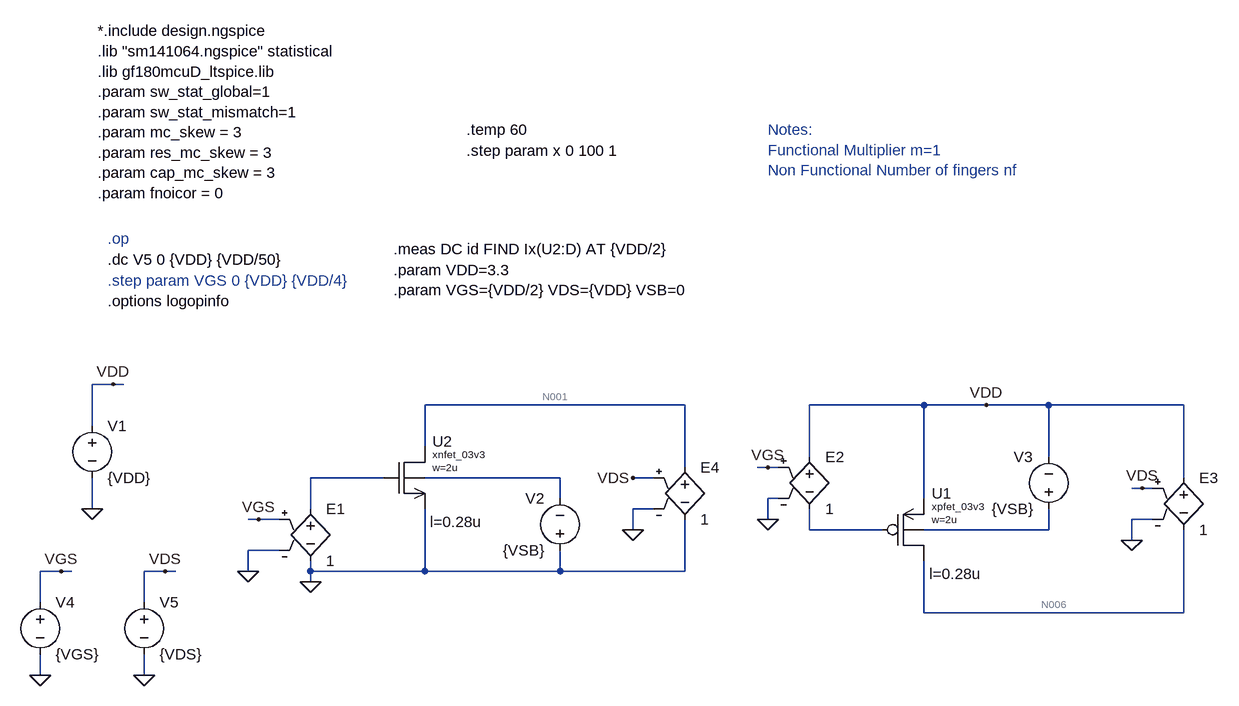
[diagram p0: schematic DC_Sweep_03V3_MC.asc]
DC_Sweep_03V3_MC.asc, the LTspice schematic file:
Version 4.1
SHEET 1 6080 1492
WIRE 80 -48 48 -48
WIRE 96 -48 80 -48
WIRE 960 -16 560 -16
WIRE 1328 -16 1152 -16
WIRE 1424 -16 1328 -16
WIRE 1520 -16 1424 -16
WIRE 1728 -16 1520 -16
WIRE 48 16 48 -48
WIRE 560 48 560 -16
WIRE 1152 64 1152 -16
WIRE 1520 64 1520 -16
WIRE 960 80 960 -16
WIRE 1088 80 1072 80
WIRE 1104 80 1088 80
WIRE 496 96 384 96
WIRE 768 96 560 96
WIRE 912 96 880 96
WIRE 1728 96 1728 -16
WIRE 1664 112 1648 112
WIRE 1680 112 1664 112
WIRE 768 128 768 96
WIRE 1104 128 1088 128
WIRE 1328 128 1328 -16
WIRE 48 144 48 96
WIRE 384 144 384 96
WIRE 912 144 880 144
WIRE 304 160 288 160
WIRE 336 160 304 160
WIRE 1088 160 1088 128
WIRE 1680 160 1648 160
WIRE 880 176 880 144
WIRE 1152 176 1152 144
WIRE 1264 176 1152 176
WIRE 1520 176 1520 144
WIRE 1520 176 1328 176
WIRE 1648 192 1648 160
WIRE 336 208 288 208
WIRE 0 240 -32 240
WIRE 16 240 0 240
WIRE 160 240 128 240
WIRE 176 240 160 240
WIRE 288 240 288 208
WIRE 384 240 384 224
WIRE 560 240 560 144
WIRE 560 240 384 240
WIRE 768 240 768 208
WIRE 768 240 560 240
WIRE 960 240 960 160
WIRE 960 240 768 240
WIRE 384 256 384 240
WIRE -32 288 -32 240
WIRE 128 288 128 240
WIRE 1328 304 1328 224
WIRE 1728 304 1728 176
WIRE 1728 304 1328 304
WIRE -32 400 -32 368
WIRE 128 400 128 368
FLAG 80 -48 VDD
FLAG 48 144 0
FLAG 384 256 0
FLAG 1424 -16 VDD
FLAG 288 240 0
FLAG 1088 160 0
FLAG -32 400 0
FLAG 0 240 VGS
FLAG 304 160 VGS
FLAG 1088 80 VGS
FLAG 1648 192 0
FLAG 880 176 0
FLAG 1664 112 VDS
FLAG 880 96 VDS
FLAG 128 400 0
FLAG 160 240 VDS
SYMBOL voltage 48 0 R0
WINDOW 123 0 0 Left 0
WINDOW 39 0 0 Left 0
SYMATTR InstName V1
SYMATTR Value {VDD}
SYMBOL voltage 768 224 R180
WINDOW 0 24 96 Left 2
WINDOW 3 24 16 Left 2
SYMATTR InstName V2
SYMATTR Value {VSB}
SYMBOL voltage 1520 160 R180
WINDOW 0 24 96 Left 2
WINDOW 3 24 16 Left 2
SYMATTR InstName V3
SYMATTR Value {VSB}
SYMBOL e 384 128 R0
SYMATTR InstName E1
SYMATTR Value 1
SYMBOL e 1152 48 R0
SYMATTR InstName E2
SYMATTR Value 1
SYMBOL voltage -32 272 R0
SYMATTR InstName V4
SYMATTR Value {VGS}
SYMBOL e 1728 80 R0
SYMATTR InstName E3
SYMATTR Value 1
SYMBOL e 960 64 R0
SYMATTR InstName E4
SYMATTR Value 1
SYMBOL voltage 128 272 R0
SYMATTR InstName V5
SYMATTR Value {VDS}
SYMBOL xpch 1280 128 R0
WINDOW 123 56 116 Left 2
SYMATTR Value2 l=0.28u
SYMATTR InstName U1
SYMATTR Value w=2u
SYMATTR SpiceModel xpfet_03v3
SYMBOL xnch 512 48 R0
WINDOW 123 56 116 Left 2
SYMATTR Value2 l=0.28u
SYMATTR InstName U2
SYMATTR Value w=2u
SYMATTR SpiceModel xnfet_03v3
TEXT 72 -272 Left 2 ;.op
TEXT 72 -240 Left 2 !.dc V5 0 {VDD} {VDD/50}
TEXT 512 -224 Left 2 !.param VDD=3.3 \n.param VGS={VDD/2} VDS={VDD} VSB=0
TEXT 72 -208 Left 2 ;.step param VGS 0 {VDD} {VDD/4}
TEXT 72 -176 Left 2 !.options logopinfo
TEXT 56 -592 Left 2 !*.include design.ngspice\n.lib "sm141064.ngspice" statistical\n.lib gf180mcuD_ltspice.lib\n.param sw_stat_global=1\n.param sw_stat_mismatch=1\n.param mc_skew = 3\n.param res_mc_skew = 3\n.param cap_mc_skew = 3\n.param fnoicor = 0
TEXT 624 -440 Left 2 !.temp 60
TEXT 624 -408 Left 2 !.step param x 0 100 1
TEXT 512 -256 Left 2 !.meas DC id FIND Ix(U2:D) AT {VDD/2}
TEXT 1088 -440 Left 2 ;Notes:\nFunctional Multiplier m=1\nNon Functional Number of fingers nf

The netlist it stands for:
* DC_Sweep_03V3_MC.asc
V1 VDD 0 {VDD}
V2 0 N003 {VSB}
V3 N005 VDD {VSB}
E1 N002 0 VGS 0 1
E2 VDD N004 VGS 0 1
V4 VGS 0 {VGS}
E3 VDD N006 VDS 0 1
E4 N001 0 VDS 0 1
V5 VDS 0 {VDS}
X§U1 N006 N004 VDD N005 xpfet_03v3 w=2u l=0.28u  ; pins D G S B
X§U2 N001 N002 0 N003 xnfet_03v3 w=2u l=0.28u  ; pins D G S B
* .op
.dc V5 0 {VDD} {VDD/50}
.param VDD=3.3
.param VGS={VDD/2} VDS={VDD} VSB=0
* .step param VGS 0 {VDD} {VDD/4}
.options logopinfo
*.include design.ngspice
.lib "sm141064.ngspice" statistical
.lib gf180mcuD_ltspice.lib
.param sw_stat_global=1
.param sw_stat_mismatch=1
.param mc_skew = 3
.param res_mc_skew = 3
.param cap_mc_skew = 3
.param fnoicor = 0
.temp 60
.step param x 0 100 1
.meas DC id FIND Ix(U2:D) AT {VDD/2}
* Notes:
* Functional Multiplier m=1
* Non Functional Number of fingers nf
.backanno
.end

* Results of the author's LTspice run, read from the files saved beside the schematic
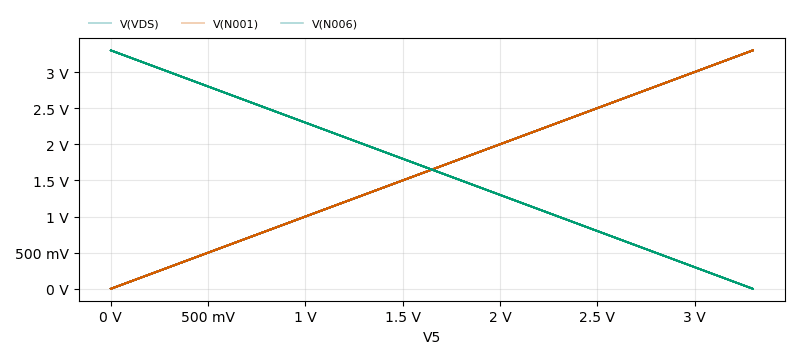
[diagram p1: DC transfer characteristic of DC_Sweep_03V3_MC.asc, plotted from the saved traces]
* DC transfer characteristic, 101 runs:
*   V(VDS) [run 1]: 0 V at V5=0 V, 3.3 V at V5=3.3 V, min 0 V, max 3.3 V
*   V(VDS) [run 2]: 0 V at V5=0 V, 3.3 V at V5=3.3 V, min 0 V, max 3.3 V
*   V(VDS) [run 3]: 0 V at V5=0 V, 3.3 V at V5=3.3 V, min 0 V, max 3.3 V
*   V(VDS) [run 4]: 0 V at V5=0 V, 3.3 V at V5=3.3 V, min 0 V, max 3.3 V
*   V(VDS) [run 5]: 0 V at V5=0 V, 3.3 V at V5=3.3 V, min 0 V, max 3.3 V
*   V(VDS) [run 6]: 0 V at V5=0 V, 3.3 V at V5=3.3 V, min 0 V, max 3.3 V
*   V(VDS) [run 7]: 0 V at V5=0 V, 3.3 V at V5=3.3 V, min 0 V, max 3.3 V
*   V(VDS) [run 8]: 0 V at V5=0 V, 3.3 V at V5=3.3 V, min 0 V, max 3.3 V
*   V(N001) [run 1]: 0 V at V5=0 V, 3.3 V at V5=3.3 V, min 0 V, max 3.3 V
*   V(N001) [run 2]: 0 V at V5=0 V, 3.3 V at V5=3.3 V, min 0 V, max 3.3 V
*   V(N001) [run 3]: 0 V at V5=0 V, 3.3 V at V5=3.3 V, min 0 V, max 3.3 V
*   V(N001) [run 4]: 0 V at V5=0 V, 3.3 V at V5=3.3 V, min 0 V, max 3.3 V
*   V(N001) [run 5]: 0 V at V5=0 V, 3.3 V at V5=3.3 V, min 0 V, max 3.3 V
*   V(N001) [run 6]: 0 V at V5=0 V, 3.3 V at V5=3.3 V, min 0 V, max 3.3 V
*   V(N001) [run 7]: 0 V at V5=0 V, 3.3 V at V5=3.3 V, min 0 V, max 3.3 V
*   V(N001) [run 8]: 0 V at V5=0 V, 3.3 V at V5=3.3 V, min 0 V, max 3.3 V
*   V(N006) [run 1]: 3.3 V at V5=0 V, 0 V at V5=3.3 V, min 0 V, max 3.3 V
*   V(N006) [run 2]: 3.3 V at V5=0 V, 0 V at V5=3.3 V, min 0 V, max 3.3 V
*   V(N006) [run 3]: 3.3 V at V5=0 V, 0 V at V5=3.3 V, min 0 V, max 3.3 V
*   V(N006) [run 4]: 3.3 V at V5=0 V, 0 V at V5=3.3 V, min 0 V, max 3.3 V
*   V(N006) [run 5]: 3.3 V at V5=0 V, 0 V at V5=3.3 V, min 0 V, max 3.3 V
*   V(N006) [run 6]: 3.3 V at V5=0 V, 0 V at V5=3.3 V, min 0 V, max 3.3 V
*   V(N006) [run 7]: 3.3 V at V5=0 V, 0 V at V5=3.3 V, min 0 V, max 3.3 V
*   V(N006) [run 8]: 3.3 V at V5=0 V, 0 V at V5=3.3 V, min 0 V, max 3.3 V
* From the log:
*   Measurement: id
*     step  Ix(U2:D)   at
*        1  0.000345501961419  1.65
*        2  0.000250997283729  1.65
*        3  0.000360172154615  1.65
*        4  0.000198675537831  1.65
*        5  0.000331643124809  1.65
*        6  0.000306394125801  1.65
*        7  0.000254957034485  1.65
*        8  0.000312837131787  1.65
*        9  0.000322775711538  1.65
*       10  0.000266885297606  1.65
*       11  0.000344073196175  1.65
*       12  0.000299871026073  1.65
*       13  0.000228627191973  1.65
*       14  0.000296763493679  1.65
*       15  0.00032905844273  1.65
*       16  0.00024403493444  1.65
*       17  0.000298732775263  1.65
*       18  0.000302630767692  1.65
*       19  0.000217457447434  1.65
*       20  0.000226773190661  1.65
*       21  0.00029978324892  1.65
*       22  0.000368090579286  1.65
*       23  0.000288365437882  1.65
*       24  0.000223202645429  1.65
*       25  0.000277218350675  1.65
*       26  0.000294507946819  1.65
*       27  0.0001883393561  1.65
*       28  0.000286523922114  1.65
*       29  0.00031237769872  1.65
*       30  0.000306591799017  1.65
*       31  0.000239875880652  1.65
*       32  0.000330096518155  1.65
*       33  0.000305157416733  1.65
*       34  0.000259106134763  1.65
*       35  0.000316890276736  1.65
*       36  0.000272066186881  1.65
*       37  0.000252513185842  1.65
*       38  0.000288175593596  1.65
*       39  0.00037019510637  1.65
*       40  0.000311283307383  1.65
*     ...